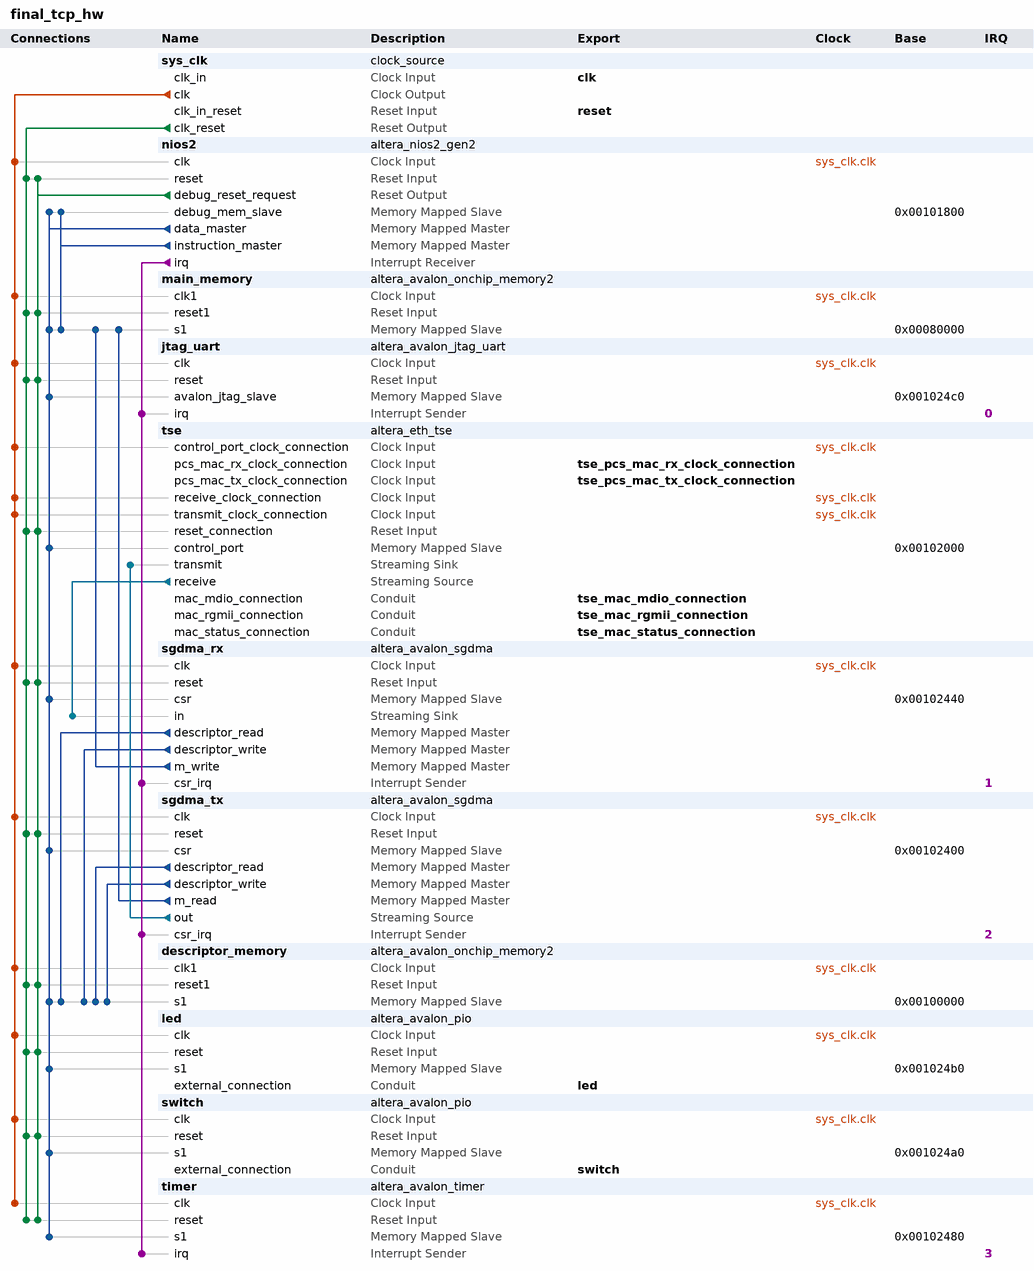
[diagram p0: system contents]
# Platform Designer (Qsys) system final_tcp_hw, Cyclone IV GX EP4CGX150DF31C7
# Parameters at their usual value, and those the tool derives, are not listed.
package require -exact qsys 17.1
create_system final_tcp_hw
set_project_property DEVICE_FAMILY {Cyclone IV GX}
set_project_property DEVICE EP4CGX150DF31C7

add_instance sys_clk clock_source 17.1
set_instance_parameter_value sys_clk clockFrequency 100000000

add_instance nios2 altera_nios2_gen2 17.1
set_instance_parameter_value nios2 dcache_size 2048
set_instance_parameter_value nios2 exceptionSlave main_memory.s1
set_instance_parameter_value nios2 icache_size 4096
set_instance_parameter_value nios2 impl Fast
set_instance_parameter_value nios2 resetSlave main_memory.s1

add_instance main_memory altera_avalon_onchip_memory2 17.1
set_instance_parameter_value main_memory dataWidth 32
set_instance_parameter_value main_memory dualPort false
set_instance_parameter_value main_memory initMemContent true
set_instance_parameter_value main_memory initializationFileName onchip_mem.hex
set_instance_parameter_value main_memory memorySize 307200

add_instance jtag_uart altera_avalon_jtag_uart 17.1
set_instance_parameter_value jtag_uart simInteractiveOptions NO_INTERACTIVE_WINDOWS

add_instance tse altera_eth_tse 17.1
set_instance_parameter_value tse XCVR_RCFG_JTAG_ENABLE 0
set_instance_parameter_value tse XCVR_SET_CAPABILITY_REG_ENABLE 0
set_instance_parameter_value tse XCVR_SET_CSR_SOFT_LOGIC_ENABLE 0
set_instance_parameter_value tse XCVR_SET_PRBS_SOFT_LOGIC_ENABLE 0
set_instance_parameter_value tse XCVR_SET_USER_IDENTIFIER 0
set_instance_parameter_value tse core_variation MAC_ONLY
set_instance_parameter_value tse enable_hd_logic true
set_instance_parameter_value tse enable_mac_flow_ctrl false
set_instance_parameter_value tse enable_magic_detect false
set_instance_parameter_value tse enable_shift16 true
set_instance_parameter_value tse ifGMII RGMII
set_instance_parameter_value tse ing_addr 11
set_instance_parameter_value tse mdio_clk_div 40
set_instance_parameter_value tse stat_cnt_ena true
set_instance_parameter_value tse transceiver_type NONE

add_instance sgdma_rx altera_avalon_sgdma 17.1
set_instance_parameter_value sgdma_rx enableBurstTransfers false
set_instance_parameter_value sgdma_rx enableUnalignedTransfers false
set_instance_parameter_value sgdma_rx readBlockDataWidth 32
set_instance_parameter_value sgdma_rx sinkErrorWidth 6
set_instance_parameter_value sgdma_rx sourceErrorWidth 0
set_instance_parameter_value sgdma_rx transferMode STREAM_TO_MEMORY
set_instance_parameter_value sgdma_rx writeBurstcountWidth 4

add_instance sgdma_tx altera_avalon_sgdma 17.1
set_instance_parameter_value sgdma_tx enableBurstTransfers false
set_instance_parameter_value sgdma_tx enableUnalignedTransfers false
set_instance_parameter_value sgdma_tx readBlockDataWidth 32
set_instance_parameter_value sgdma_tx sinkErrorWidth 0
set_instance_parameter_value sgdma_tx sourceErrorWidth 1
set_instance_parameter_value sgdma_tx transferMode MEMORY_TO_STREAM
set_instance_parameter_value sgdma_tx writeBurstcountWidth 4

add_instance descriptor_memory altera_avalon_onchip_memory2 17.1
set_instance_parameter_value descriptor_memory dataWidth 32
set_instance_parameter_value descriptor_memory dualPort false
set_instance_parameter_value descriptor_memory initMemContent true
set_instance_parameter_value descriptor_memory initializationFileName onchip_mem.hex
set_instance_parameter_value descriptor_memory memorySize 4096

add_instance led altera_avalon_pio 17.1
set_instance_parameter_value led direction Output
set_instance_parameter_value led width 1

add_instance switch altera_avalon_pio 17.1
set_instance_parameter_value switch direction Input
set_instance_parameter_value switch width 1

add_instance timer altera_avalon_timer 17.1
set_instance_parameter_value timer period 1000
set_instance_parameter_value timer periodUnits CLOCKS

# connections
add_connection sys_clk.clk descriptor_memory.clk1 clock
add_connection sys_clk.clk jtag_uart.clk clock
add_connection sys_clk.clk led.clk clock
add_connection sys_clk.clk main_memory.clk1 clock
add_connection sys_clk.clk nios2.clk clock
add_connection sys_clk.clk sgdma_rx.clk clock
add_connection sys_clk.clk sgdma_tx.clk clock
add_connection sys_clk.clk switch.clk clock
add_connection sys_clk.clk timer.clk clock
add_connection sys_clk.clk tse.control_port_clock_connection clock
add_connection sys_clk.clk tse.receive_clock_connection clock
add_connection sys_clk.clk tse.transmit_clock_connection clock
add_connection nios2.debug_reset_request descriptor_memory.reset1 reset
add_connection nios2.debug_reset_request jtag_uart.reset reset
add_connection nios2.debug_reset_request led.reset reset
add_connection nios2.debug_reset_request main_memory.reset1 reset
add_connection nios2.debug_reset_request nios2.reset reset
add_connection nios2.debug_reset_request sgdma_rx.reset reset
add_connection nios2.debug_reset_request sgdma_tx.reset reset
add_connection nios2.debug_reset_request switch.reset reset
add_connection nios2.debug_reset_request timer.reset reset
add_connection nios2.debug_reset_request tse.reset_connection reset
add_connection sys_clk.clk_reset descriptor_memory.reset1 reset
add_connection sys_clk.clk_reset jtag_uart.reset reset
add_connection sys_clk.clk_reset led.reset reset
add_connection sys_clk.clk_reset main_memory.reset1 reset
add_connection sys_clk.clk_reset nios2.reset reset
add_connection sys_clk.clk_reset sgdma_rx.reset reset
add_connection sys_clk.clk_reset sgdma_tx.reset reset
add_connection sys_clk.clk_reset switch.reset reset
add_connection sys_clk.clk_reset timer.reset reset
add_connection sys_clk.clk_reset tse.reset_connection reset
add_connection nios2.data_master descriptor_memory.s1 avalon
set_connection_parameter_value nios2.data_master/descriptor_memory.s1 baseAddress 0x00100000
add_connection nios2.data_master jtag_uart.avalon_jtag_slave avalon
set_connection_parameter_value nios2.data_master/jtag_uart.avalon_jtag_slave baseAddress 0x001024c0
add_connection nios2.data_master led.s1 avalon
set_connection_parameter_value nios2.data_master/led.s1 baseAddress 0x001024b0
add_connection nios2.data_master main_memory.s1 avalon
set_connection_parameter_value nios2.data_master/main_memory.s1 baseAddress 0x00080000
add_connection nios2.data_master nios2.debug_mem_slave avalon
set_connection_parameter_value nios2.data_master/nios2.debug_mem_slave baseAddress 0x00101800
add_connection nios2.data_master sgdma_rx.csr avalon
set_connection_parameter_value nios2.data_master/sgdma_rx.csr baseAddress 0x00102440
add_connection nios2.data_master sgdma_tx.csr avalon
set_connection_parameter_value nios2.data_master/sgdma_tx.csr baseAddress 0x00102400
add_connection nios2.data_master switch.s1 avalon
set_connection_parameter_value nios2.data_master/switch.s1 baseAddress 0x001024a0
add_connection nios2.data_master timer.s1 avalon
set_connection_parameter_value nios2.data_master/timer.s1 baseAddress 0x00102480
add_connection nios2.data_master tse.control_port avalon
set_connection_parameter_value nios2.data_master/tse.control_port baseAddress 0x00102000
add_connection nios2.instruction_master main_memory.s1 avalon
set_connection_parameter_value nios2.instruction_master/main_memory.s1 baseAddress 0x00080000
add_connection nios2.instruction_master nios2.debug_mem_slave avalon
set_connection_parameter_value nios2.instruction_master/nios2.debug_mem_slave baseAddress 0x00101800
add_connection sgdma_rx.descriptor_read descriptor_memory.s1 avalon
set_connection_parameter_value sgdma_rx.descriptor_read/descriptor_memory.s1 baseAddress 0x00100000
add_connection sgdma_rx.descriptor_write descriptor_memory.s1 avalon
set_connection_parameter_value sgdma_rx.descriptor_write/descriptor_memory.s1 baseAddress 0x00100000
add_connection sgdma_rx.m_write main_memory.s1 avalon
set_connection_parameter_value sgdma_rx.m_write/main_memory.s1 baseAddress 0x00080000
add_connection sgdma_tx.descriptor_read descriptor_memory.s1 avalon
set_connection_parameter_value sgdma_tx.descriptor_read/descriptor_memory.s1 baseAddress 0x00100000
add_connection sgdma_tx.descriptor_write descriptor_memory.s1 avalon
set_connection_parameter_value sgdma_tx.descriptor_write/descriptor_memory.s1 baseAddress 0x00100000
add_connection sgdma_tx.m_read main_memory.s1 avalon
set_connection_parameter_value sgdma_tx.m_read/main_memory.s1 baseAddress 0x00080000
add_connection sgdma_tx.out tse.transmit avalon_streaming
add_connection tse.receive sgdma_rx.in avalon_streaming
add_connection nios2.irq jtag_uart.irq interrupt
set_connection_parameter_value nios2.irq/jtag_uart.irq irqNumber 0
add_connection nios2.irq sgdma_rx.csr_irq interrupt
set_connection_parameter_value nios2.irq/sgdma_rx.csr_irq irqNumber 1
add_connection nios2.irq sgdma_tx.csr_irq interrupt
set_connection_parameter_value nios2.irq/sgdma_tx.csr_irq irqNumber 2
add_connection nios2.irq timer.irq interrupt
set_connection_parameter_value nios2.irq/timer.irq irqNumber 3

# exported interfaces
add_interface clk clock sink
set_interface_property clk EXPORT_OF sys_clk.clk_in
add_interface led conduit end
set_interface_property led EXPORT_OF led.external_connection
add_interface reset reset sink
set_interface_property reset EXPORT_OF sys_clk.clk_in_reset
add_interface switch conduit end
set_interface_property switch EXPORT_OF switch.external_connection
add_interface tse_mac_mdio_connection conduit end
set_interface_property tse_mac_mdio_connection EXPORT_OF tse.mac_mdio_connection
add_interface tse_mac_rgmii_connection conduit end
set_interface_property tse_mac_rgmii_connection EXPORT_OF tse.mac_rgmii_connection
add_interface tse_mac_status_connection conduit end
set_interface_property tse_mac_status_connection EXPORT_OF tse.mac_status_connection
add_interface tse_pcs_mac_rx_clock_connection clock sink
set_interface_property tse_pcs_mac_rx_clock_connection EXPORT_OF tse.pcs_mac_rx_clock_connection
add_interface tse_pcs_mac_tx_clock_connection clock sink
set_interface_property tse_pcs_mac_tx_clock_connection EXPORT_OF tse.pcs_mac_tx_clock_connection

set_interconnect_requirement {$system} qsys_mm.clockCrossingAdapter HANDSHAKE
set_interconnect_requirement {$system} qsys_mm.enableEccProtection FALSE
set_interconnect_requirement {$system} qsys_mm.insertDefaultSlave FALSE
set_interconnect_requirement {$system} qsys_mm.maxAdditionalLatency 1

save_system final_tcp_hw.qsys
